# Altium schematic sheet Sheet1.SchDoc
size A4
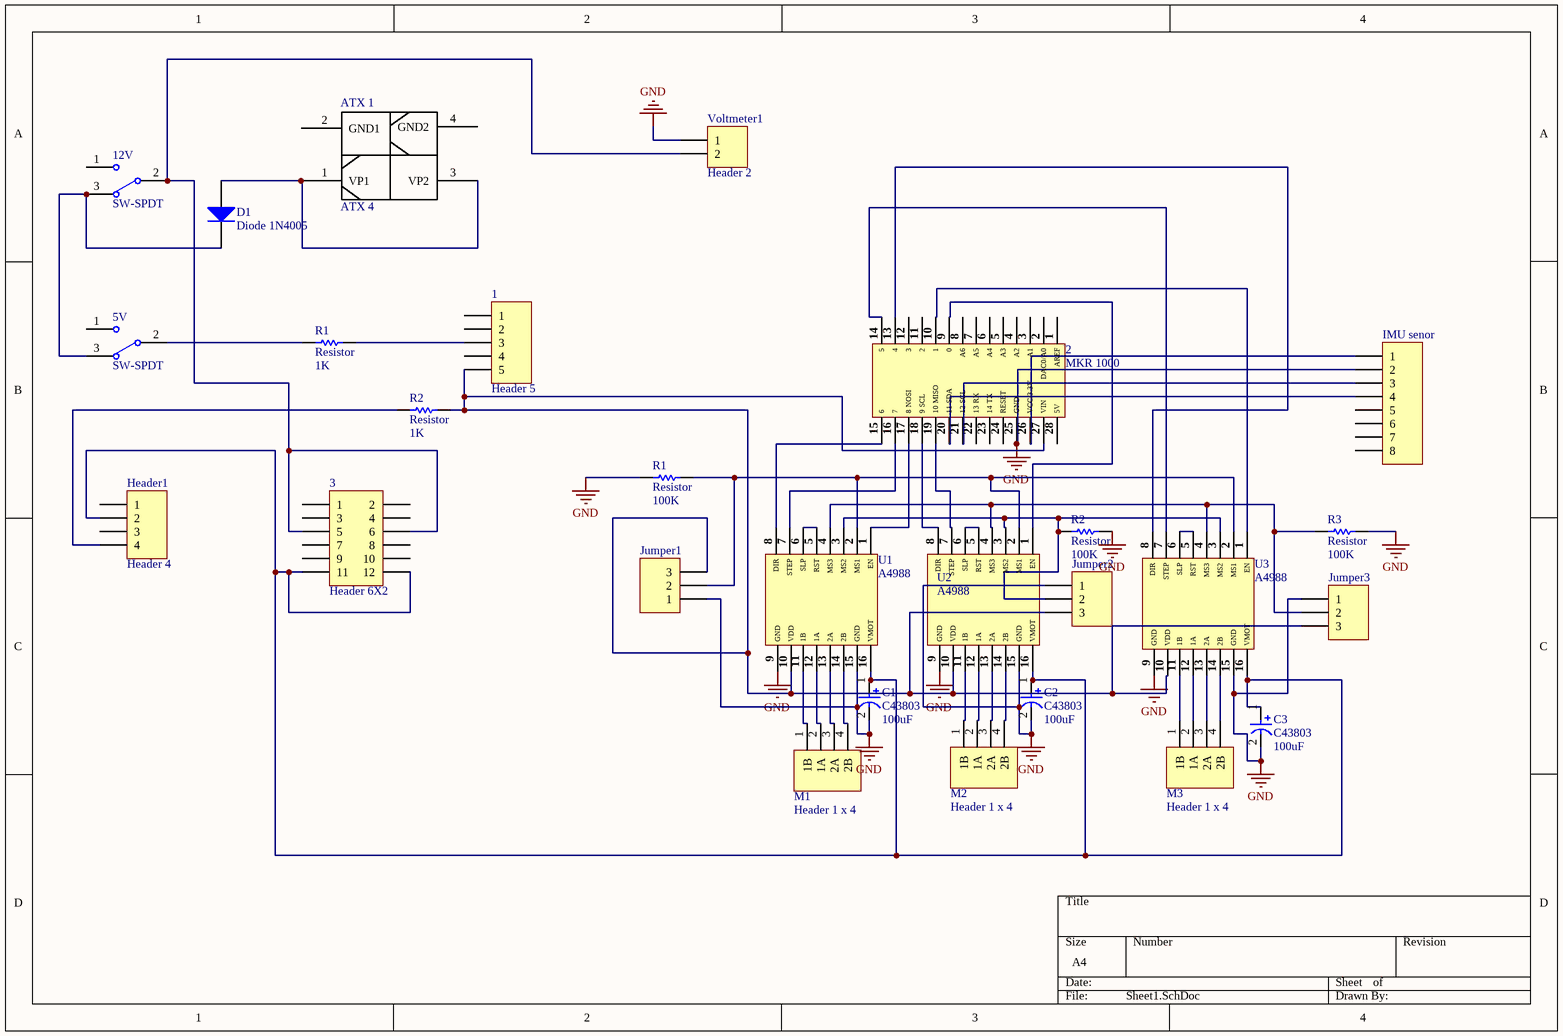
[diagram p0: Sheet1.SchDoc]

## Parts
(Parts that share a designator on the sheet are numbered #1, #2 ... from top to bottom, then left to right.)
1  Header 5  [HDR1X5]
2  MKR 1000  [MKR1000]
3  Header 6X2  [HDR2X6]
5V  SW-SPDT  [SPDT]
12V  SW-SPDT  [SPDT]
ATX_1  ATX 4  [ATX4]
C1  C43803  value 100uF  [C43803]
C2  C43803  value 100uF  [C43803]
C3  C43803  value 100uF  [C43803]
D1  Diode 1N4005  [DO-41]
Header1  Header 4  [HDR1X4]
IMU_senor  (no value)  [HDR1X8]
Jumper1  (no value)  [HDR1X3]
Jumper2  (no value)  [HDR1X3]
Jumper3  (no value)  [HDR1X3]
M1  Header 1 x 4  [HDR1X4]
M2  Header 1 x 4  [HDR1X4]
M3  Header 1 x 4  [HDR1X4]
R1#1  Resistor  value 1K  [AXIAL-RESISTOR]
R1#2  Resistor  value 100K  [AXIAL-RESISTOR]
R2#1  Resistor  value 1K  [AXIAL-RESISTOR]
R2#2  Resistor  value 100K  [AXIAL-RESISTOR]
R3  Resistor  value 100K  [AXIAL-RESISTOR]
U1  A4988  [A4988 Driver]
U2  A4988  [A4988 Driver]
U3  A4988  [A4988 Driver]
Voltmeter1  Header 2  [HDR1X2]

## Nets
GND: 2.25(GND) C1.2 C2.2 C3.2 IMU_senor.2 Jumper1.1 Jumper2.1 Jumper3.1 R1#2.1 R2#2.2 R3.2 U1.9(GND) U1.15(GND) U2.9(GND) U2.15(GND) U3.9(GND) U3.15(GND) Voltmeter1.1
Net1_3: 1.3 R1#1.2
Net1_5: 1.5 2.27(VIN) Jumper1.3 Jumper2.3 Jumper3.3 R2#1.2 U1.10(VDD) U2.10(VDD) U3.10(VDD)
Net2_9: 2.9(0) U2.1(EN)
Net2_10: 2.10(1) U3.1(EN)
Net2_13: 2.13(4) U3.8(DIR)
Net2_14: 2.14(5) U3.7(STEP)
Net2_15: 2.15(6) U1.8(DIR)
Net2_16: 2.16(7) U1.7(STEP)
Net2_17: 2.17(8_NOSI) U1.1(EN)
Net2_18: 2.18(9_SCL) U2.8(DIR)
Net2_19: 2.19(10_MISO) U2.7(STEP)
Net2_20: 2.20(11_SDA) IMU_senor.4
Net2_21: 2.21(12_SCL) IMU_senor.3
Net2_26: 2.26(VCC/3.3V) IMU_senor.1
Net3_5: 3.5 3.6 12V.2 Voltmeter1.2
Net3_11: 3.11 3.12 C1.1 C2.1 C3.1 Header1.2 U1.16(VMOT) U2.16(VMOT) U3.16(VMOT)
Net5V_2: 5V.2 R1#1.1
Net5V_3: 5V.3 12V.3 D1.2(K)
NetATX_1_1: ATX_1.1(VP1) ATX_1.3(VP2) D1.1(A)
NetHeader1_4: Header1.4 R2#1.1
NetJumper1_2: Jumper1.2 R1#2.2 U1.2(MS1) U2.2(MS1) U3.2(MS1)
NetJumper2_2: Jumper2.2 R2#2.1 U1.3(MS2) U2.3(MS2) U3.3(MS2)
NetJumper3_2: Jumper3.2 R3.1 U1.4(MS3) U2.4(MS3) U3.4(MS3)
NetM1_1: M1.1(1B) U1.11(1B)
NetM1_2: M1.2(1A) U1.12(1A)
NetM1_3: M1.3(2A) U1.13(2A)
NetM1_4: M1.4(2B) U1.14(2B)
NetM2_1: M2.1(1B) U2.11(1B)
NetM2_2: M2.2(1A) U2.12(1A)
NetM2_3: M2.3(2A) U2.13(2A)
NetM2_4: M2.4(2B) U2.14(2B)
NetM3_1: M3.1(1B) U3.11(1B)
NetM3_2: M3.2(1A) U3.12(1A)
NetM3_3: M3.3(2A) U3.13(2A)
NetM3_4: M3.4(2B) U3.14(2B)
NetU1_5: U1.5(RST) U1.6(SLP)
NetU2_5: U2.5(RST) U2.6(SLP)
NetU3_5: U3.5(RST) U3.6(SLP)

Not connected (* = marked no-connect by the designer): 1 1 2 4; 2 1(AREF) 2(DAC0/A0) 3(A1) 4(A2) 5(A3) 6(A4) 7(A5) 8(A6) 11(2) 12(3) 22(13_RX) 23(14_TX) 24(RESET) 28(5V); 3 1 2 3 4 7 8 9 10; 5V 1; 12V 1; ATX_1 2(GND1) 4(GND2); Header1 1 3; IMU_senor 5 6 7 8

## Library data of the parts
1 = Header 5: Header, 5-Pin; LatestRevisionDate: 17-Jul-2002; LatestRevisionNote: Re-released for DXP Platform.; Publisher: Altium Limited
2 = Arduino MKR 1000: Arduino wifi
3 = Header 6X2: Header, 6-Pin, Dual row; LatestRevisionDate: 17-Jul-2002; LatestRevisionNote: Re-released for DXP Platform.; Publisher: Altium Limited
5V 12V = SW-SPDT: SPDT Subminiature Toggle Switch, Right Angle Mounting, Vertical Actuation; Published: 24-Mar-1999; LatestRevisionDate: 17-Dec-2003; LatestRevisionNote: Schematic revised, PCB Footprint replaced.; DatasheetVersion: 05-Dec-2000; PackageReference: TL36WW15050; Publisher: Altium Limited; PackageDescription: Switch; 4 Leads; ComponentLink1Description: Manufacturer Link; ComponentLink1URL: http://www.apem.com
ATX_1 = ATX 4: ATX 4Pins power connector
C1-C3 = C43803: Polarized Capacitor C43803 100uF; Published: 8-Jun-2000; LatestRevisionDate: 29-May-2009; LatestRevisionNote: IPC-7351 Footprint Added.; PackageReference: C0805; Publisher: Altium Limited; PackageDescription: Chip Capacitor
D1 = Diode 1N4005: 1 Amp General Purpose Rectifier; Published: 8-Jun-2000; LatestRevisionDate: 17-Jul-2002; LatestRevisionNote: Re-released for DXP Platform.; DatasheetVersion: 1998; PackageVersion: Aug-1999; PackageReference: DO-41; Publisher: Altium Limited; PackageDescription: Diode, Axial; Body 5.2 x 2.7 mm (LxDia. max), Lead Dia. 0.86 mm (max); Code_JEDEC: DO-204-AL; ComponentLink1Description: Manufacturer Link; ComponentLink1URL: http://www.fairchildsemi.com/; ComponentLink2Description: Datasheet; ComponentLink2URL: http://www.fairchildsemi.com/ds/1N%2F1N4001.pdf
Header1 = Header 4: Header, 4-Pin; LatestRevisionDate: 17-Jul-2002; LatestRevisionNote: Re-released for DXP Platform.; Publisher: Altium Limited
IMU_senor = Header 8: Header, 8-Pin; LatestRevisionDate: 17-Jul-2002; LatestRevisionNote: Re-released for DXP Platform.; Publisher: Altium Limited
Jumper1-Jumper3 = Header 3: Header, 3-Pin; LatestRevisionDate: 17-Jul-2002; LatestRevisionNote: Re-released for DXP Platform.; Publisher: Altium Limited
M1-M3 = Header 1 x 4: Header, 4-Pin; LatestRevisionDate: 17-Jul-2002; LatestRevisionNote: Re-released for DXP Platform.; Publisher: Altium Limited
U1-U3 = A4988 Driver: Motor Driver
Voltmeter1 = Header 2: Header, 2-Pin; LatestRevisionDate: 17-Jul-2002; LatestRevisionNote: Re-released for DXP Platform.; Publisher: Altium Limited
R1#1 R1#2 R2#1 R2#2 R3 = Resistor: Published: 8-Jun-2000; LatestRevisionDate: 17-Jul-2002; LatestRevisionNote: Re-released for DXP Platform.; PackageReference: AXIAL-0.3; Publisher: Altium Limited; PackageDescription: Axial Device, Thru-Hole; 2 Leads; 0.3 in Pin Spacing